# EAGLE design triState (EAGLE 9.6.2)
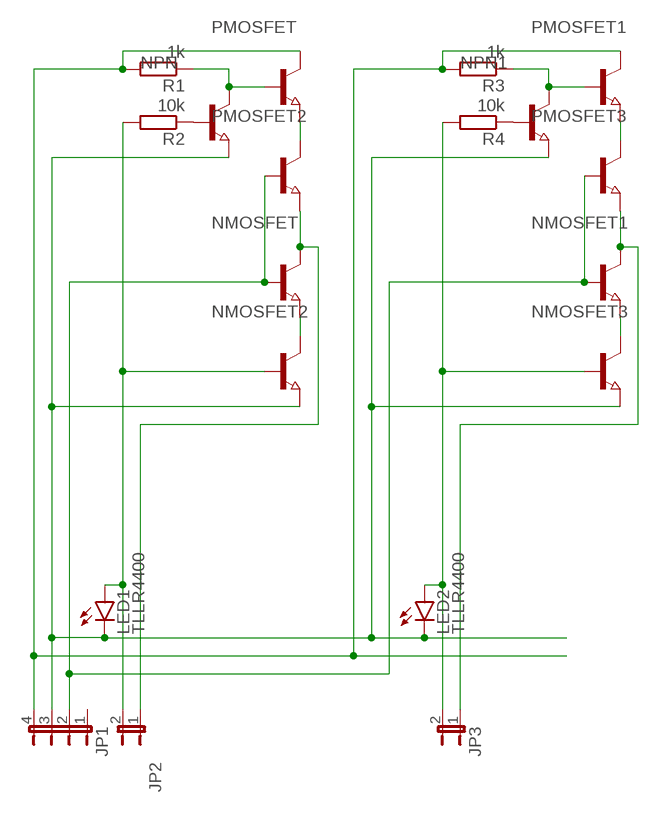
[diagram p0: schematic, sheet 1]

## Parts
JP1  JP4E  [JP4]
JP2  JP1E  [JP1]
JP3  JP1E  [JP1]
LED1  TLLR4400  [LED3MM]
LED2  TLLR4400  [LED3MM]
NMOSFET  NPN-TRANSISTOR_SOT23  [SOT23]
NMOSFET1  NPN-TRANSISTOR_SOT23  [SOT23]
NMOSFET2  NPN-TRANSISTOR_SOT23  [SOT23]
NMOSFET3  NPN-TRANSISTOR_SOT23  [SOT23]
NPN  NPN-TRANSISTOR_SOT23  [SOT23]
NPN1  NPN-TRANSISTOR_SOT23  [SOT23]
PMOSFET  NPN-TRANSISTOR_SOT23  [SOT23]
PMOSFET1  NPN-TRANSISTOR_SOT23  [SOT23]
PMOSFET2  NPN-TRANSISTOR_SOT23  [SOT23]
PMOSFET3  NPN-TRANSISTOR_SOT23  [SOT23]
R1  1k  R-EU_R1206  [R1206]
R2  10k  R-EU_R1206  [R1206]
R3  1k  R-EU_R1206  [R1206]
R4  10k  R-EU_R1206  [R1206]

## Nets
DI0: JP2.2 LED1.A NMOSFET2.1(B) R2.2
DI1: JP3.2 LED2.A NMOSFET3.1(B) R4.2
DO0: JP2.1 NMOSFET.3(C) PMOSFET2.2(E)
DO1: JP3.1 NMOSFET1.3(C) PMOSFET3.2(E)
GND: JP1.3 LED1.K(C) LED2.K(C) NMOSFET2.2(E) NMOSFET3.2(E) NPN1.2(E) NPN.2(E)
N$1: NPN.3(C) PMOSFET.1(B) R1.1
N$2: NPN.1(B) R2.1
N$5: PMOSFET2.3(C) PMOSFET.2(E)
N$7: NMOSFET2.3(C) NMOSFET.2(E)
N$10: NPN1.1(B) R4.1
N$11: NPN1.3(C) PMOSFET1.1(B) R3.1
N$14: PMOSFET1.2(E) PMOSFET3.3(C)
N$16: NMOSFET1.2(E) NMOSFET3.3(C)
OE: JP1.2 NMOSFET1.1(B) NMOSFET.1(B) PMOSFET2.1(B) PMOSFET3.1(B)
VCC: JP1.4 PMOSFET1.3(C) PMOSFET.3(C) R1.2 R3.2
Unconnected: JP1.1

## Library data of the parts
JP1 = jumper:JP4E: JUMPER
JP2 JP3 = jumper:JP1E: JUMPER
LED1 LED2 = led:TLLR4400: Low Current (2mA) LED 3 mm Tinted Diffused Package color RED Source: Data sheet <http://www.farnell.com/datasheets/391100.pdf>; MF: VISHAY SEMICONDUCTOR; OC_FARNELL: 1612437
NMOSFET NMOSFET1-NMOSFET3 NPN NPN1 PMOSFET PMOSFET1-PMOSFET3 = semicon-smd-ipc:NPN-TRANSISTOR_: NPN TRANSISTOR
R1-R4 = rcl:R-EU_: RESISTOR, European symbol; SPICEPREFIX: R

## Board
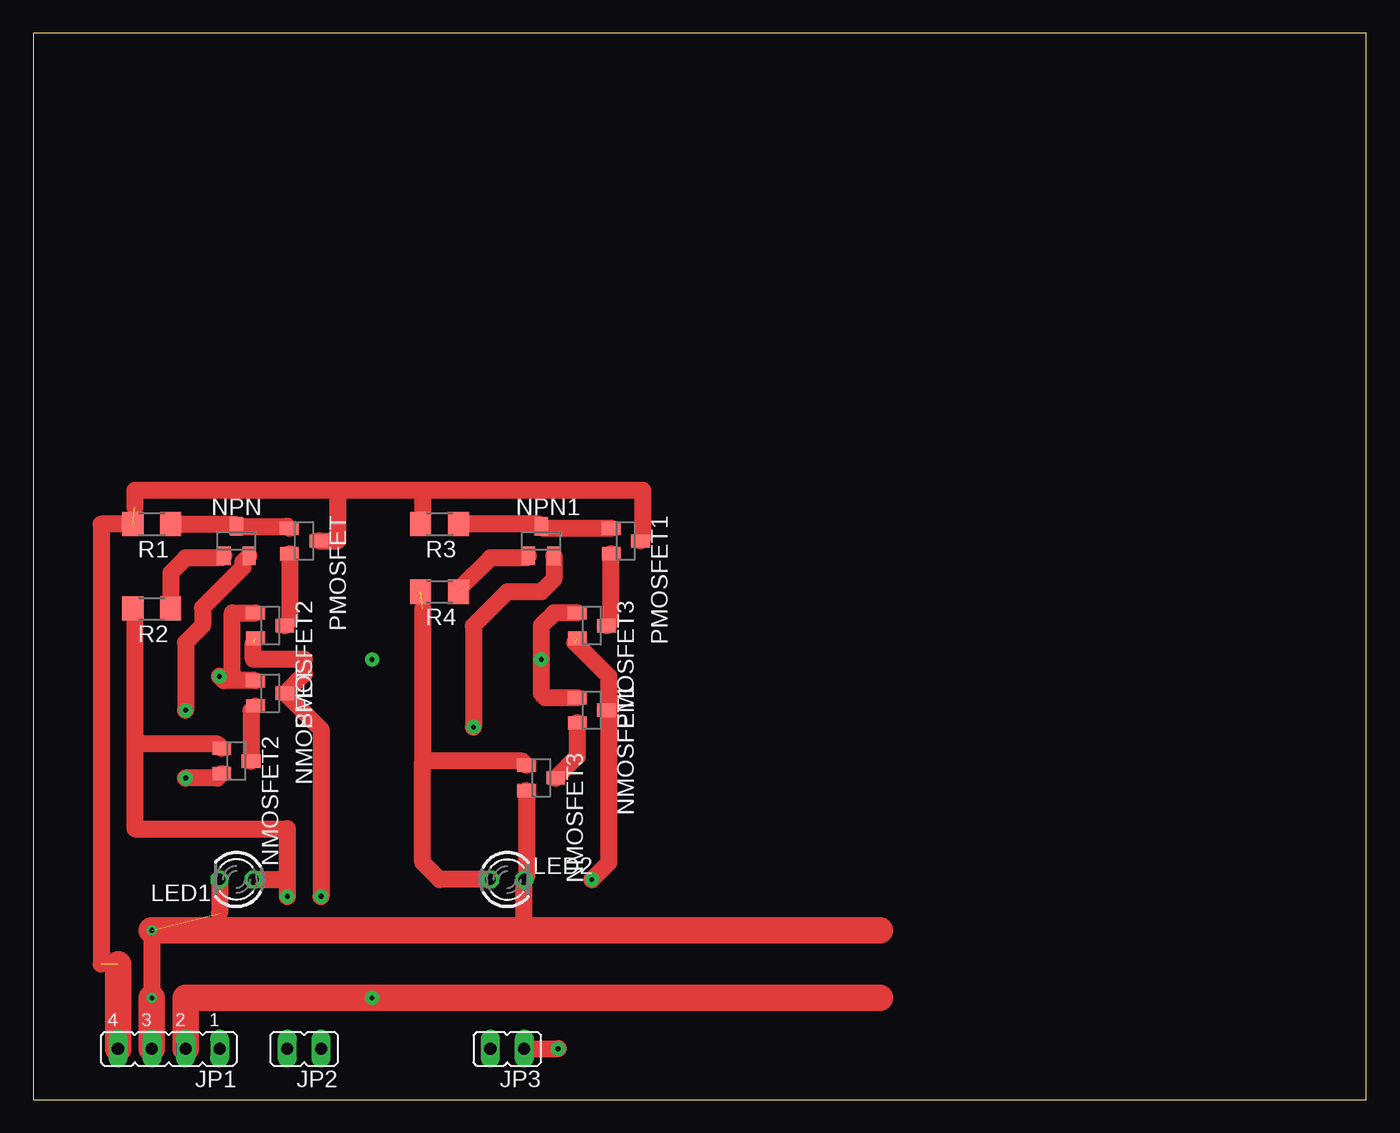
[diagram p1: board, top side]
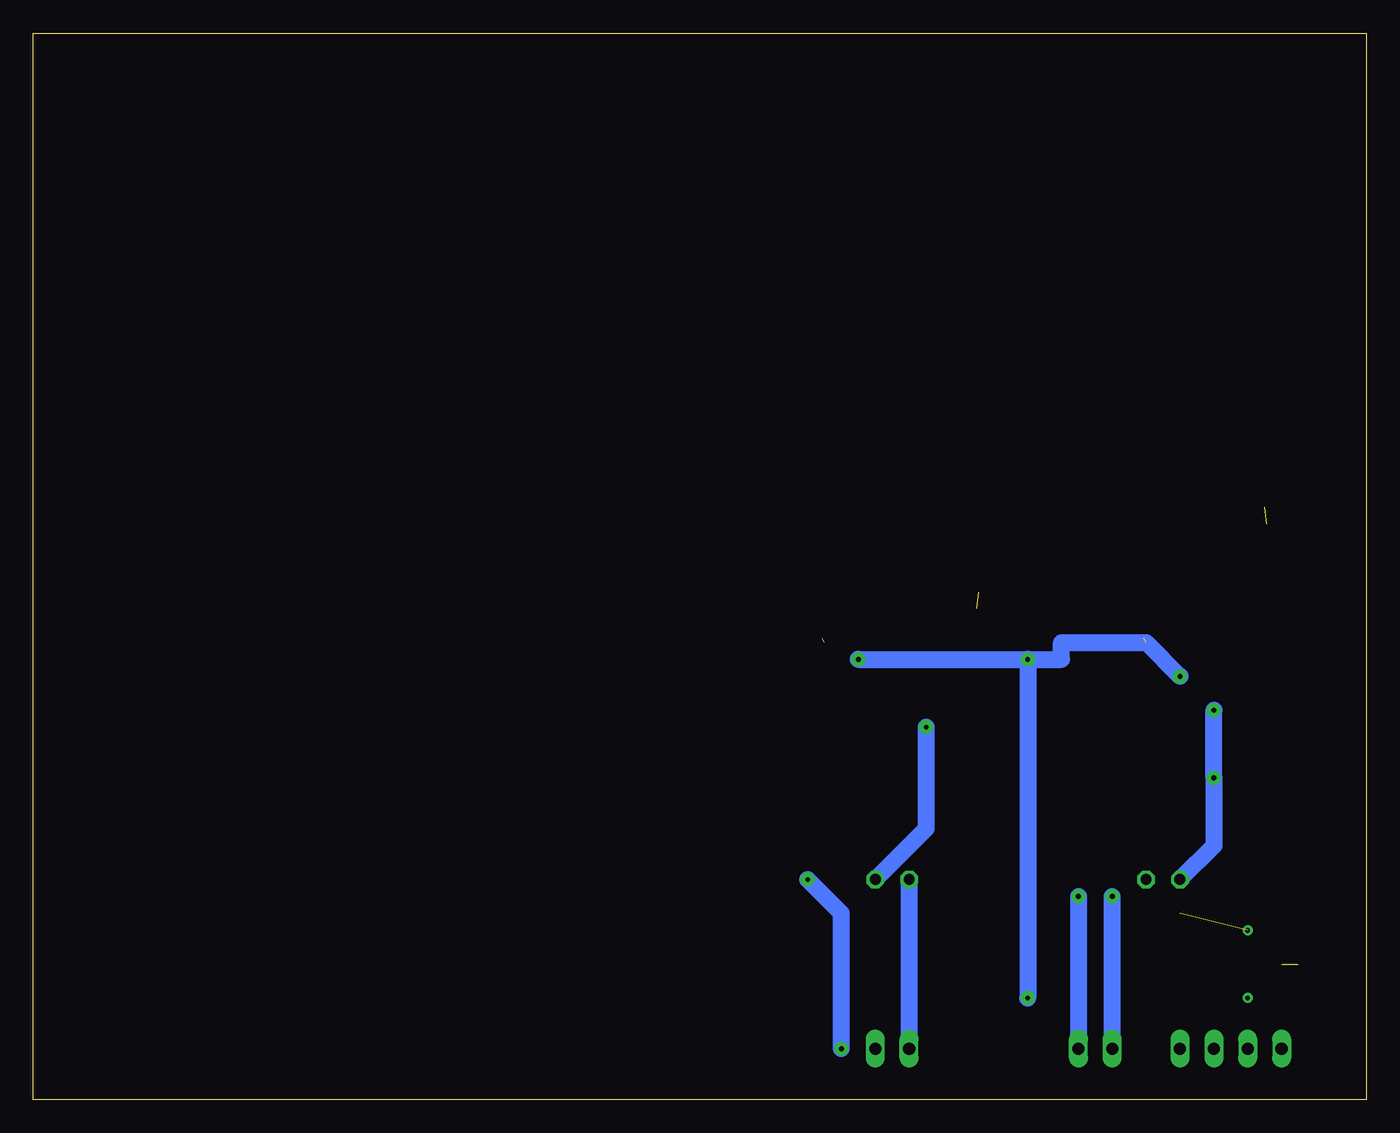
[diagram p2: board, bottom side, seen from below]

Size 100 x 80 mm. Coordinates in mm from the lower left corner, seen from the top.
Outline: 0,0 100,0 100,80 0,80 0,0
Copper layers (1*16): Top 0.035mm / dielectric 1.5mm / Bottom 0.035mm
Design rules "default *": minimum track width 0.5mm, minimum drill 0.35mm, track to track 6mil, track to pad 6mil, pad to pad 6mil, via to via 6mil, smd to smd 6mil, copper to edge 40mil, drill to drill 6mil, minimum pad ring 10mil, minimum via ring 8mil, stop-mask expansion 4mil, vias tented up to drill 0mil, thermal gap 10mil

### Footprints (pad centres in the part's own frame; a part is rotated, then mirrored left to right if it is on the bottom)
JP4 = drill 0.914 long: 1 -3.81,0; 2 -1.27,0; 3 1.27,0; 4 3.81,0
JP1 = drill 0.914 long: 1 0,-1.27; 2 0,1.27
LED3MM = drill 0.813 octagon: A -1.27,0; K 1.27,0
SOT23 = smd 1 x 1.4: 1 -0.95,-1.1; 2 0.95,-1.1; 3 0,1.1
R1206 = smd 1.6 x 1.803: 1 -1.422,0; 2 1.422,0

### Placement (x,y rotation side)
JP1  10.16,3.81 180 top
JP2  20.32,3.81 90 top
JP3  35.56,3.81 90 top
LED1  15.24,16.51 180 top
LED2  35.56,16.51 0 top
NMOSFET  17.78,30.48 270 top
NMOSFET1  41.91,29.21 270 top
NMOSFET2  15.24,25.4 270 top
NMOSFET3  38.1,24.13 270 top
NPN  15.24,41.91 0 top
NPN1  38.1,41.91 0 top
PMOSFET  20.32,41.91 270 top
PMOSFET1  44.45,41.91 270 top
PMOSFET2  17.78,35.56 270 top
PMOSFET3  41.91,35.56 270 top
R1  8.89,43.18 180 top
R2  8.89,36.83 180 top
R3  30.48,43.18 180 top
R4  30.48,38.1 180 top

### Tracks (layer width: path | path; a pad name or v marks a point on that pad's centre or on a via)
DI0  (via drill 0.35 pad 1.05)
  Top 1.27: 19.05,16.51 19.05,20.32 7.62,20.32 7.62,26.67 | 19.05,16.51 v19.05,15.24 | R2.2 7.62,36.68 7.62,26.67 | NMOSFET2.1 13.82,26.67 7.62,26.67 | LED1.A 19.05,16.51
  Bottom 1.27: JP2.2 v19.05,15.24
DI1  (1 unrouted)
  Top 1.27: NMOSFET3.1 36.68,25.4 29.21,25.4 | 29.21,36.83 29.21,25.4 | LED2.A 30.48,16.51 29.21,17.78 29.21,25.4
  Bottom 1.27: LED2.A JP3.2
DO0  (via drill 0.35 pad 1.05)  (1 unrouted)
  Top 1.27: 16.51,34.29 16.51,33.02 20.32,33.02 20.32,31.92 NMOSFET.3 21.59,27.77 v21.59,15.24
  Bottom 1.27: v21.59,15.24 JP2.1
DO1  (via drill 0.35 pad 1.05)  (1 unrouted)
  Top 1.27: JP3.1 v39.37,3.81 | v41.91,16.51 43.18,17.78 43.18,29.21 | 43.18,29.21 43.18,31.75 40.64,34.29 | NMOSFET1.3 43.18,29.21
  Bottom 1.27: v39.37,3.81 39.37,13.97 v41.91,16.51
GND  (via drill 0.35, 0.35 pad 1.05)  (1 unrouted)
  Top 1.27: LED1.K 13.97,13.97 | NPN.2 15.71,40.33 15.71,39.92 12.7,36.91 12.7,35.56 11.43,34.29 v11.43,29.21 | NMOSFET2.2 13.82,24.13 v11.43,24.13 | v8.89,12.7 v8.89,7.62 | 36.83,12.7 LED2.K 37,16.68 NMOSFET3.2 | NPN1.2 39.05,39.05 38.1,38.1 35.56,38.1 33.02,35.56 v33.02,27.94
  Top 2: JP1.3 v8.89,7.62 | v8.89,12.7 36.83,12.7 63.5,12.7
  Bottom 1.27: v11.43,29.21 v11.43,24.13 11.43,19.05 LED1.K | LED2.K 33.02,20.32 v33.02,27.94
N$1
  Top 1.27: R1.1 15.07,43.18 NPN.3 19.07,43.01 PMOSFET.1
N$2
  Top 1.27: R2.1 10.31,39.52 11.43,40.64 14.12,40.64 NPN.1
N$5
  Top 1.27: PMOSFET.2 19.22,35.9 PMOSFET2.3
N$7
  Top 1.27: NMOSFET.2 16.34,29.19 NMOSFET2.3
N$10
  Top 1.27: NPN1.1 36.98,40.64 34.29,40.64 31.9,38.25 R4.1
N$11
  Top 1.27: PMOSFET1.1 38.25,42.86 NPN1.3 37.93,43.18 R3.1
N$14
  Top 1.27: PMOSFET3.3 43.35,35.9 PMOSFET1.2
N$16
  Top 1.27: NMOSFET1.2 40.81,25.74 NMOSFET3.3
OE  (via drill 0.35 pad 1.05)
  Top 1.27: NMOSFET.1 14.29,31.43 | v13.97,31.75 14.29,31.43 | PMOSFET2.1 14.92,36.51 14.92,32.06 14.29,31.43 | PMOSFET3.1 39.05,36.51 38.1,35.56 v38.1,33.02 38.1,30.48 38.42,30.16 NMOSFET1.1
  Top 2: JP1.2 11.43,7.62 v25.4,7.62 63.5,7.62
  Bottom 1.27: v13.97,31.75 16.51,34.29 22.86,34.29 22.86,33.02 v25.4,33.02 | v38.1,33.02 v25.4,33.02 | v25.4,33.02 v25.4,7.62
VCC  (2 unrouted)
  Top 1.27: R1.2 5.08,43.18 5.08,10.16 | PMOSFET.3 22.86,41.91 22.86,45.72 | 22.86,45.72 7.62,45.72 7.62,44.45 | 22.86,45.72 29.21,45.72 | 29.21,45.72 29.21,43.33 R3.2 | 29.21,45.72 45.72,45.72 45.72,42.08 PMOSFET1.3
  Top 2: JP1.4 6.35,10.16